# Altium schematic sheet Phase Voltages.SchDoc
size A4
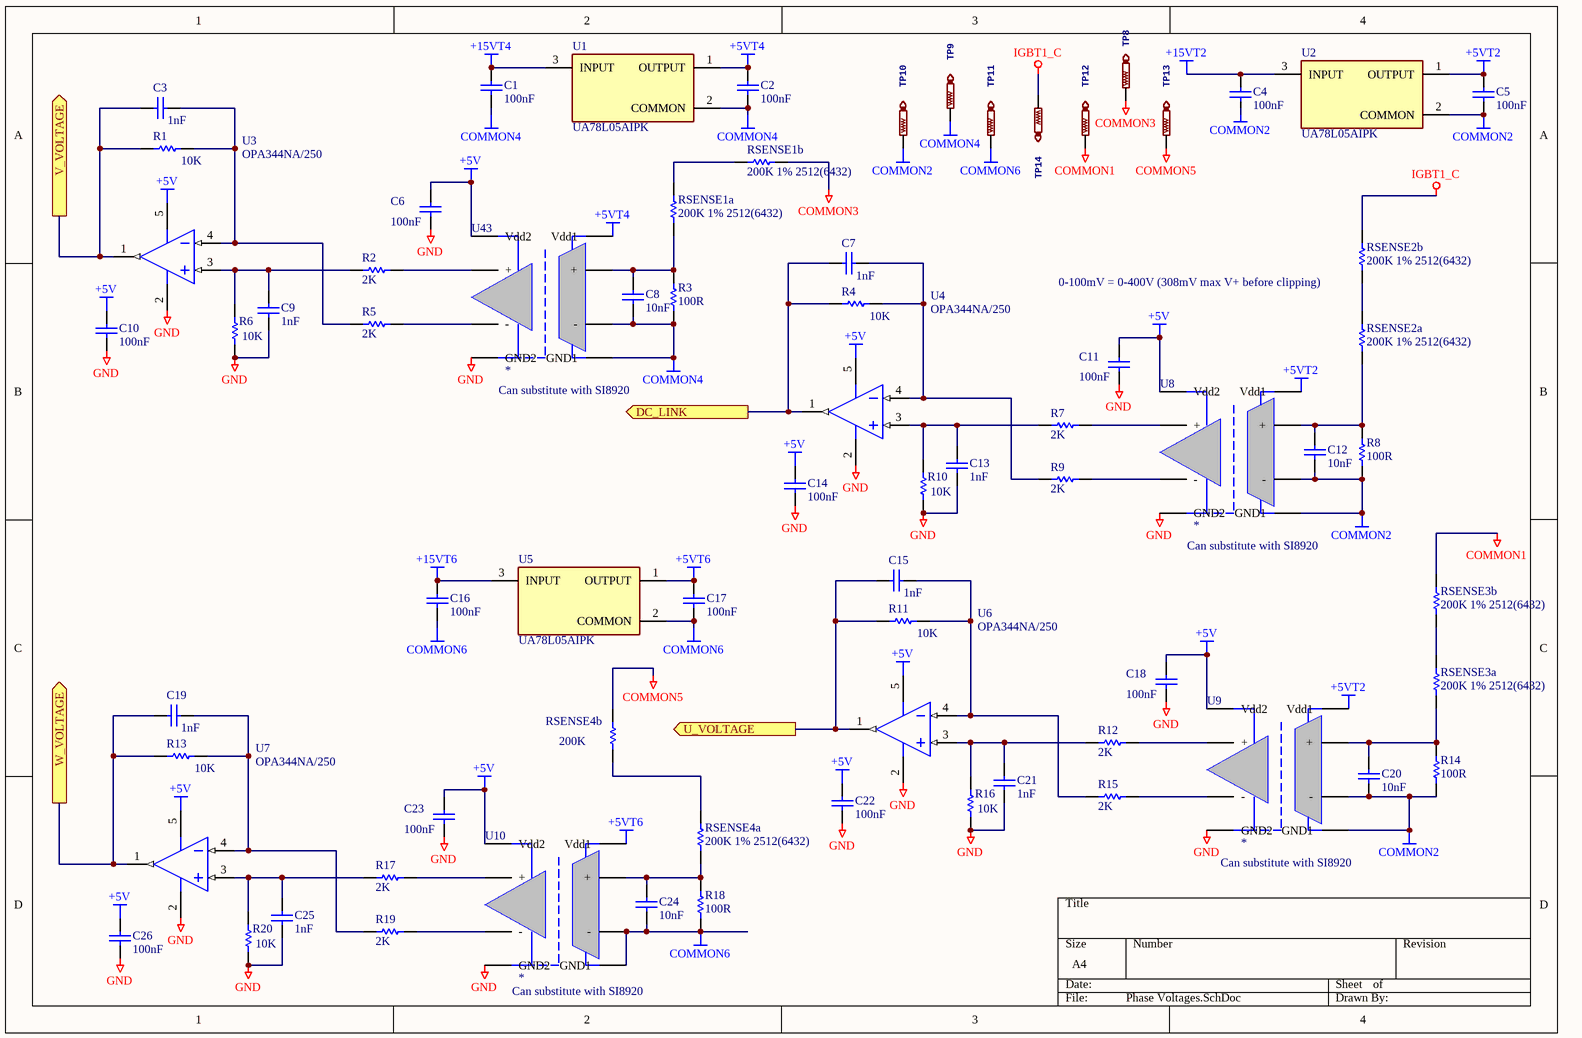
[diagram p0: Phase Voltages.SchDoc]

## Parts
C1  value 100nF  [CAPC0805(2012)75_N]  (hidden comment: CAP 100nF 25V 0805(2012))
C2  value 100nF  [CAPC0805(2012)75_N]  (hidden comment: CAP 100nF 25V 0805(2012))
C3  value 1nF  [CAPC0805(2012)145_L]  (hidden comment: CAP 1nF 16V 0805(2012))
C4  value 100nF  [CAPC0805(2012)75_N]  (hidden comment: CAP 100nF 25V 0805(2012))
C5  value 100nF  [CAPC0805(2012)75_N]  (hidden comment: CAP 100nF 25V 0805(2012))
C6  value 100nF  [CAPC0805(2012)75_N]  (hidden comment: CAP 100nF 25V 0805(2012))
C7  value 1nF  [CAPC0805(2012)145_L]  (hidden comment: CAP 1nF 16V 0805(2012))
C8  value 10nF  [CAPC0805(2012)100_L]  (hidden comment: CAP 10nF 25V 0805(2012))
C9  value 1nF  [CAPC0805(2012)145_L]  (hidden comment: CAP 1nF 16V 0805(2012))
C10  value 100nF  [CAPC0805(2012)75_N]  (hidden comment: CAP 100nF 25V 0805(2012))
C11  value 100nF  [CAPC0805(2012)75_N]  (hidden comment: CAP 100nF 25V 0805(2012))
C12  value 10nF  [CAPC0805(2012)100_L]  (hidden comment: CAP 10nF 25V 0805(2012))
C13  value 1nF  [CAPC0805(2012)145_L]  (hidden comment: CAP 1nF 16V 0805(2012))
C14  value 100nF  [CAPC0805(2012)75_N]  (hidden comment: CAP 100nF 25V 0805(2012))
C15  value 1nF  [CAPC0805(2012)145_L]  (hidden comment: CAP 1nF 16V 0805(2012))
C16  value 100nF  [CAPC0805(2012)75_N]  (hidden comment: CAP 100nF 25V 0805(2012))
C17  value 100nF  [CAPC0805(2012)75_N]  (hidden comment: CAP 100nF 25V 0805(2012))
C18  value 100nF  [CAPC0805(2012)75_N]  (hidden comment: CAP 100nF 25V 0805(2012))
C19  value 1nF  [CAPC0805(2012)145_L]  (hidden comment: CAP 1nF 16V 0805(2012))
C20  value 10nF  [CAPC0805(2012)100_L]  (hidden comment: CAP 10nF 25V 0805(2012))
C21  value 1nF  [CAPC0805(2012)145_L]  (hidden comment: CAP 1nF 16V 0805(2012))
C22  value 100nF  [CAPC0805(2012)75_N]  (hidden comment: CAP 100nF 25V 0805(2012))
C23  value 100nF  [CAPC0805(2012)75_N]  (hidden comment: CAP 100nF 25V 0805(2012))
C24  value 10nF  [CAPC0805(2012)100_L]  (hidden comment: CAP 10nF 25V 0805(2012))
C25  value 1nF  [CAPC0805(2012)145_L]  (hidden comment: CAP 1nF 16V 0805(2012))
C26  value 100nF  [CAPC0805(2012)75_N]  (hidden comment: CAP 100nF 25V 0805(2012))
R1  value 10K  [RESC0805(2012)_M]  (hidden comment: 10K 1% 0805(2012))
R2  value 2K  [RESC0805(2012)_L]  (hidden comment: 2K 1% 0805(2012))
R3  value 100R  [RESC0805(2012)_L]  (hidden comment: 100R 1% 0805(2012))
R4  value 10K  [RESC0805(2012)_M]  (hidden comment: 10K 1% 0805(2012))
R5  value 2K  [RESC0805(2012)_L]  (hidden comment: 2K 1% 0805(2012))
R6  value 10K  [RESC0805(2012)_M]  (hidden comment: 10K 1% 0805(2012))
R7  value 2K  [RESC0805(2012)_L]  (hidden comment: 2K 1% 0805(2012))
R8  value 100R  [RESC0805(2012)_L]  (hidden comment: 100R 1% 0805(2012))
R9  value 2K  [RESC0805(2012)_L]  (hidden comment: 2K 1% 0805(2012))
R10  value 10K  [RESC0805(2012)_M]  (hidden comment: 10K 1% 0805(2012))
R11  value 10K  [RESC0805(2012)_M]  (hidden comment: 10K 1% 0805(2012))
R12  value 2K  [RESC0805(2012)_L]  (hidden comment: 2K 1% 0805(2012))
R13  value 10K  [RESC0805(2012)_M]  (hidden comment: 10K 1% 0805(2012))
R14  value 100R  [RESC0805(2012)_L]  (hidden comment: 100R 1% 0805(2012))
R15  value 2K  [RESC0805(2012)_L]  (hidden comment: 2K 1% 0805(2012))
R16  value 10K  [RESC0805(2012)_M]  (hidden comment: 10K 1% 0805(2012))
R17  value 2K  [RESC0805(2012)_L]  (hidden comment: 2K 1% 0805(2012))
R18  value 100R  [RESC0805(2012)_L]  (hidden comment: 100R 1% 0805(2012))
R19  value 2K  [RESC0805(2012)_L]  (hidden comment: 2K 1% 0805(2012))
R20  value 10K  [RESC0805(2012)_M]  (hidden comment: 10K 1% 0805(2012))
RSENSE1a  200K 1% 2512(6432)  [RESC2512(6432)_M]
RSENSE1b  200K 1% 2512(6432)  [RESC2512(6432)_M]
RSENSE2a  200K 1% 2512(6432)  [RESC2512(6432)_M]
RSENSE2b  200K 1% 2512(6432)  [RESC2512(6432)_M]
RSENSE3a  200K 1% 2512(6432)  [RESC2512(6432)_M]
RSENSE3b  200K 1% 2512(6432)  [RESC2512(6432)_M]
RSENSE4a  200K 1% 2512(6432)  [RESC2512(6432)_M]
RSENSE4b  value 200K  [RESC2512(6432)_M]  (hidden comment: 200K 1% 2512(6432))
TP8  PTR1PAD1-13  [P1-13]  (value not drawn)
TP9  PTR1PAD1-13  [P1-13]  (value not drawn)
TP10  PTR1PAD1-13  [P1-13]  (value not drawn)
TP11  PTR1PAD1-13  [P1-13]  (value not drawn)
TP12  PTR1PAD1-13  [P1-13]  (value not drawn)
TP13  PTR1PAD1-13  [P1-13]  (value not drawn)
TP14  PTR1PAD1-13  [P1-13]  (value not drawn)
U1  UA78L05AIPK  [FP-PK0003A-MFG]
U2  UA78L05AIPK  [FP-PK0003A-MFG]
U3  OPA344NA/250  [DBV0005A_L]
U4  OPA344NA/250  [DBV0005A_L]
U5  UA78L05AIPK  [FP-PK0003A-MFG]
U6  OPA344NA/250  [DBV0005A_L]
U7  OPA344NA/250  [DBV0005A_L]
U8  *  [SOP8]
U9  *  [SOP8]
U10  *  [SOP8]
U43  *  [SOP8]

## Ports
DC_LINK (out), U_VOLTAGE (out), V_VOLTAGE (out), W_VOLTAGE (out)

## Nets
+5V: C6.1 C10.1 C11.1 C14.1 C18.1 C22.1 C23.1 C26.1 U3.5(V+) U4.5(V+) U6.5(V+) U7.5(V+) U8.8(Vdd2) U9.8(Vdd2) U10.8(Vdd2) U43.8(Vdd2)
+5VT2: C5.2 U2.1(OUTPUT) U8.1(Vdd1) U9.1(Vdd1)
+5VT4: C2.2 U1.1(OUTPUT) U43.1(Vdd1)
+5VT6: C17.2 U5.1(OUTPUT) U10.1(Vdd1)
+15VT2: C4.2 U2.3(INPUT)
+15VT4: C1.2 U1.3(INPUT)
+15VT6: C16.2 U5.3(INPUT)
COMMON1: RSENSE3b.2 TP12.TP
COMMON2: C4.1 C5.1 C12.1 C20.1 R8.2 R14.2 TP10.TP U2.2(COMMON) U8.3(-) U8.4(GND1) U9.3(-) U9.4(GND1)
COMMON3: RSENSE1b.1 TP8.TP
COMMON4: C1.1 C2.1 C8.1 R3.2 TP9.TP U1.2(COMMON) U43.3(-) U43.4(GND1)
COMMON5: RSENSE4b.2 TP13.TP
COMMON6: C16.1 C17.1 C24.1 R18.2 TP11.TP U5.2(COMMON) U10.3(-) U10.4(GND1)
GND: C6.2 C9.1 C10.2 C11.2 C13.1 C14.2 C18.2 C21.1 C22.2 C23.2 C25.1 C26.2 R6.1 R10.1 R16.1 R20.1 U3.2(V-) U4.2(V-) U6.2(V-) U7.2(V-) U8.5(GND2) U9.5(GND2) U10.5(GND2) U43.5(GND2)
IGBT1_C: RSENSE2b.2 TP14.TP
DC_LINK: C7.1 R4.1 U4.1(OUT) ; port DC_LINK
U_VOLTAGE: C15.1 R11.1 U6.1(OUT) ; port U_VOLTAGE
V_VOLTAGE: C3.1 R1.1 U3.1(OUT) ; port V_VOLTAGE
W_VOLTAGE: C19.1 R13.1 U7.1(OUT) ; port W_VOLTAGE
NetC3_2: C3.2 R1.2 R5.2 U3.4(IN-)
NetC7_2: C7.2 R4.2 R9.2 U4.4(IN-)
NetC8_2: C8.2 R3.1 RSENSE1a.1 U43.2(+)
NetC9_2: C9.2 R2.2 R6.2 U3.3(IN+)
NetC12_2: C12.2 R8.1 RSENSE2a.1 U8.2(+)
NetC13_2: C13.2 R7.2 R10.2 U4.3(IN+)
NetC15_2: C15.2 R11.2 R15.2 U6.4(IN-)
NetC19_2: C19.2 R13.2 R19.2 U7.4(IN-)
NetC20_2: C20.2 R14.1 RSENSE3a.1 U9.2(+)
NetC21_2: C21.2 R12.2 R16.2 U6.3(IN+)
NetC24_2: C24.2 R18.1 RSENSE4a.1 U10.2(+)
NetC25_2: C25.2 R17.2 R20.2 U7.3(IN+)
NetR2_1: R2.1 U43.7(+)
NetR5_1: R5.1 U43.6(-)
NetR7_1: R7.1 U8.7(+)
NetR9_1: R9.1 U8.6(-)
NetR12_1: R12.1 U9.7(+)
NetR15_1: R15.1 U9.6(-)
NetR17_1: R17.1 U10.7(+)
NetR19_1: R19.1 U10.6(-)
NetRSENSE1a_2: RSENSE1a.2 RSENSE1b.2
NetRSENSE2a_2: RSENSE2a.2 RSENSE2b.1
NetRSENSE3a_2: RSENSE3a.2 RSENSE3b.1
NetRSENSE4a_2: RSENSE4a.2 RSENSE4b.1

## Notes on the sheet
- (near RSENSE2b) 0-100mV = 0-400V (308mV max V+ before clipping)
- (near U43) Can substitute with SI8920
- (near U8) Can substitute with SI8920
- (near U9) Can substitute with SI8920
- (near U10) Can substitute with SI8920

## Library data of the parts
C1 C2 C4-C6 C10 C11 C14 C16-C18 C22 C23 C26 = CMP-1036-04415-1: CAP 100nF 25V -20% to +80% 0805 (2012 Metric) Thickness 0.75mm SMD; Case-EIA: 0805; Case-Metric: 2012; Rated Voltage: 25 V; Tolerance: -20% to +80%; Technology: SMT; Max Thickness: 0.75 mm
C3 C7 C9 C13 C15 C19 C21 C25 = CMP-1036-02957-1: CAP 1nF 16V ±5% 0805 (2012 Metric) Thickness 1.45mm SMD; Case-Metric: 2012; Tolerance: Â±5%; Case-EIA: 0805; Rated Voltage: 16 V; Max Thickness: 1.45 mm; Technology: SMT
C8 C12 C20 C24 = CMP-1036-03829-1: CAP 10nF 25V ±5% 0805 (2012 Metric) Thickness 1mm SMD; Case-EIA: 0805; Tolerance: Â±5%; Case-Metric: 2012; Technology: SMT; Max Thickness: 1 mm; Rated Voltage: 25 V
R1 R4 R6 R10 R11 R13 R16 R20 = CMP-1013-00623-1: 10K 0.125W 1% 0805 (2012 Metric)  SMD; Case-Metric: 2012; Case-EIA: 0805; Tolerance: 1 %; Power: 0.125 W; Technology: SMT
R2 R5 R7 R9 R12 R15 R17 R19 = CMP-1013-00542-1: 2K 0.125W 1% 0805 (2012 Metric)  SMD; Case-Metric: 2012; Case-EIA: 0805; Technology: SMT; Power: 0.125 W; Tolerance: 1 %
R3 R8 R14 R18 = CMP-1013-00397-1: 100R 0.125W 1% 0805 (2012 Metric)  SMD; Case-Metric: 2012; Case-EIA: 0805; Technology: SMT; Power: 0.125 W; Tolerance: 1 %
RSENSE1a RSENSE1b RSENSE2a RSENSE2b RSENSE3a RSENSE3b RSENSE4a = CMP-1018-00768-1: 200K 1W 1% 2512 (6432 Metric)  SMD; Value: 200000.00 Ohm; Case-EIA: 2512; Case-Metric: 6432; Tolerance: 1 %; Technology: SMT; Power: 1 W
RSENSE4b = CMP-1018-00768-1: 200K 1W 1% 2512 (6432 Metric)  SMD; Case-EIA: 2512; Case-Metric: 6432; Tolerance: 1 %; Technology: SMT; Power: 1 W
TP8-TP14 = PTR1PAD1-13: TEST PIN
U1 U2 U5 = CMP-04917-000006-1: IC REG LINEAR 5V 100MA SOT89-3; Manufacturer: Texas Instruments; Max Junction Temp: +125°C; Min Supply Voltage: 7V; Output Type: Fixed; Dropout Voltage: 1.7V; Number Of Outputs: 1; Max Supply Voltage: 20V; Height: 1.6mm; ComponentLink2Description: Datasheet; Lead Free: Yes; Temperature Range High: +125°C; Package: PK0003A; Output Current: 100mA; ComponentLink2URL: http://www.ti.com/lit/ds/symlink/ua78l.pdf; Category: IC; Device Class L2: Power Management ICs; Digikey Description: IC REG LINEAR 5V 100MA SOT89-3; Temperature: -40°C to +125°C; RoHS: TRUE; Device Class L1: Integrated Circuits (ICs); Manufacturer Part Number: UA78L05AIPK; Mouser Description: Linear Voltage Regulators 5V 100mA Fixed Pos Voltage Regulator; Temperature Range Low: -40°C; Octopart: https://octopart.com/ua78l05aipk-texas+instruments-525592; Output Voltage: 5V; Device Class L3: Voltage Regulators - Linear; Automotive: No
U3 U4 U6 U7 = CMP-0272-00879-3: Low Power, Single-Supply, Rail-to-Rail Operational Amplifier MicroAmplifier(TM) Series, 2.5 to 5.5 V, -55 to 125 degC, 5-pin SOT23 (DBV5), Green (RoHS & no Sb/Br); Manufacturer: Texas Instruments; Total Supply Voltage(Max)(+5V is 5, +/-5V is 10): 5.5; Iq per channel(Max)(mA): 0.25; Vio (25C)(Max)(mV): 1; CMRR(Min)(dB): 76; Slew Rate(Typ)(V/us): 0.8; Sub Family: Low Input Bias Current Amp (<=10pA), Low Power Amp (<=500uA), Low Supply Voltage Amplifier (<=2.7V), Precision Amplifier; Total Supply Voltage(Min)(+5V is 5, +/-5V is 10): 2.5; IIB(Max)(pA): 10; Offset Drift(Typ)(uV/C): 3; PackageReference: DBV0005A; PackageVersion: 4073253-4/K, 03/2006; ComponentLink2URL: http://www.ti.com/general/docs/lit/getliterature.tsp?genericPartNumber=OPA344&fileType=pdf; PackageDescription: 5-Pin Plastic Small Outline, Body 1.6 x 2.9 mm, Pitch 0.95 mm; ComponentLink2Description: Datasheet; Eco-Plan: Green (RoHS & no Sb/Br); ComponentLink1Description: Manufacturer URL; Mounting Technology: Surface Mount; Code_JEDEC: MO-178; ComponentLink3Description: Package Specification; Number of Channels: 1; PartNumber: OPA344NA/250; ComponentLink3URL: http://www.ti.com/litv/pdf/mpds018i; ComponentLink1URL: http://www.ti.com/; DatasheetVersion: SBOS107A
U8-U10 U43 = HCPL-7800-300E